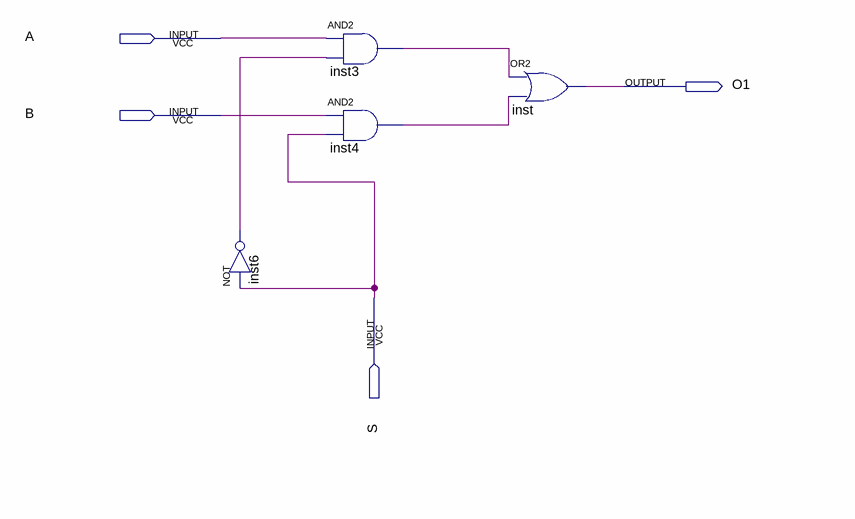
[diagram p0: schematic sheet]
// Quartus schematic multiplexer.bdf as structural Verilog: 4 symbols, 4 pins
module multiplexer (
  input  A,
  input  B,
  input  S,
  output O1
);

  wire inst3_out, inst4_out, inst6_out;

  not inst6 (inst6_out, S);
  and inst3 (inst3_out, A, inst6_out);
  and inst4 (inst4_out, B, S);
  or inst (O1, inst3_out, inst4_out);
endmodule
